# Altium schematic sheet 假肢驱动电路.SchDoc
size A1
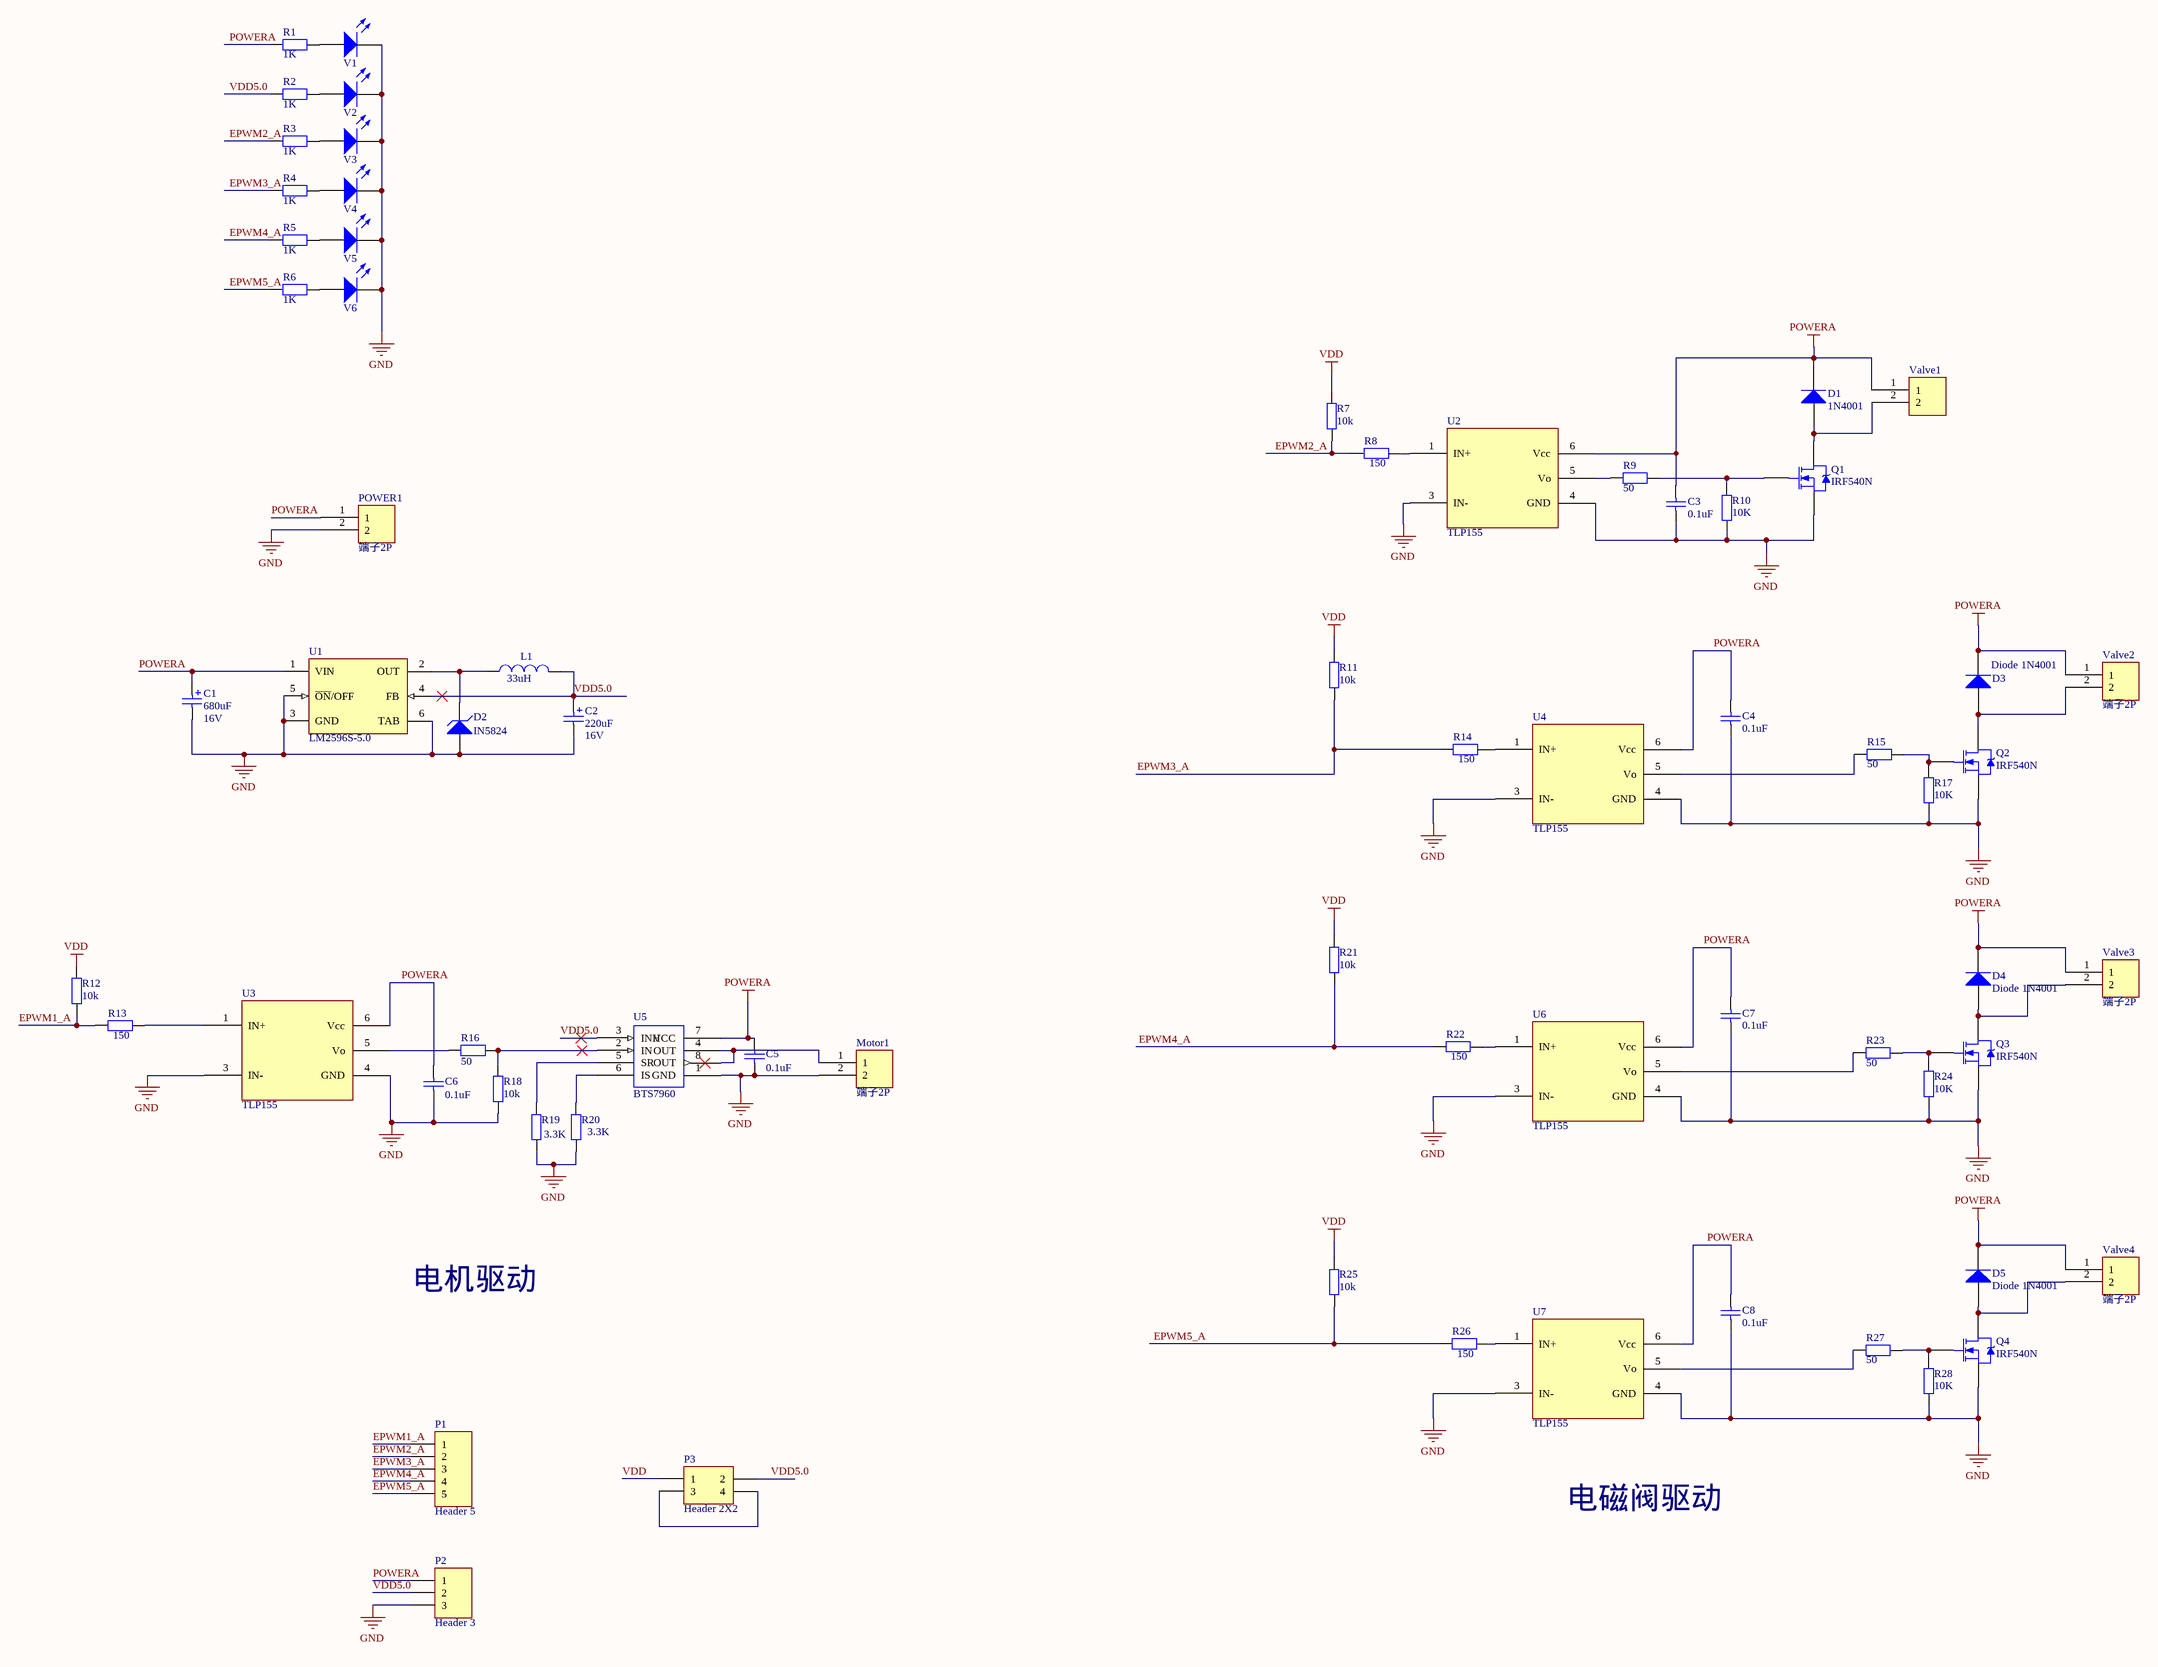
[diagram p0: 假肢驱动电路.SchDoc]

## Parts
C1  value 680uF  Voltage: 16V  [SMD-EC-F10]  (hidden comment: 10uF,16V)
C2  value 220uF  Voltage: 16V  [SMD-EC-F8]  (hidden comment: 10uF,16V)
C3  0.1uF  [LC-0805_C]
C4  0.1uF  [LC-0805_C]
C5  0.1uF  [LC-0805_C]
C6  0.1uF  [LC-0805_C]
C7  0.1uF  [LC-0805_C]
C8  0.1uF  [LC-0805_C]
D1  1N4001  [DO-41]
D2  IN5824  [LC-1206]
D3  Diode 1N4001  [DO-41]
D4  Diode 1N4001  [DO-41]
D5  Diode 1N4001  [DO-41]
L1  value 33uH  [SMD-EC-F10]  (hidden comment: Inductor)
Motor1  端子2P  [KF2EDGK5.0-LI-2P]
P1  Header 5  [XH2.54-LI-5P]
P2  Header 3  [XH2.54-LI-3P]
P3  Header 2X2  [HDR2X2]
POWER1  端子2P  [KF2EDGK5.0-LI-2P]
Q1  IRF540N  [TO-220AB]
Q2  IRF540N  [TO-220AB]
Q3  IRF540N  [TO-220AB]
Q4  IRF540N  [TO-220AB]
R1  1K  [0603-1]
R2  1K  [0603-1]
R3  1K  [0603-1]
R4  1K  [0603-1]
R5  1K  [0603-1]
R6  1K  [0603-1]
R7  10k  [LC-0805_R]
R8  150  [LC-0805_R]
R9  50  [LC-0805_R]
R10  10K  [LC-0805_R]
R11  10k  [LC-0805_R]
R12  10k  [LC-0805_R]
R13  150  [0805-1]
R14  150  [LC-0805_R]
R15  50  [LC-0805_R]
R16  50  [LC-0805_R]
R17  10K  [LC-0805_R]
R18  10k  [0805-1]
R19  3.3K  [LC-0805_R]
R20  3.3K  [LC-0805_R]
R21  10k  [LC-0805_R]
R22  150  [LC-0805_R]
R23  50  [LC-0805_R]
R24  10K  [LC-0805_R]
R25  10k  [LC-0805_R]
R26  150  [LC-0805_R]
R27  50  [LC-0805_R]
R28  10K  [LC-0805_R]
U1  LM2596S-5.0  [TS5B_N]
U2  TLP155  [so6]
U3  TLP155  [so6]
U4  TLP155  [so6]
U5  BTS7960  [BTS7960]
U6  TLP155  [so6]
U7  TLP155  [so6]
V1  LED Chip  [LED 0603G]  (value not drawn)
V2  LED Chip  [LED 0603G]  (value not drawn)
V3  LED Chip  [LED 0603R]  (value not drawn)
V4  LED Chip  [LED 0603R]  (value not drawn)
V5  LED Chip  [LED 0603R]  (value not drawn)
V6  LED Chip  [LED 0603R]  (value not drawn)
Valve1  (no value)  [KF2EDGK5.0-LI-2P]
Valve2  端子2P  [KF2EDGK5.0-LI-2P]
Valve3  端子2P  [KF2EDGK5.0-LI-2P]
Valve4  端子2P  [KF2EDGK5.0-LI-2P]

## Nets
GND: C1.2 C2.2 C3.2 C4.2 C5.2 C6.2 C7.2 C8.2 D2.1(A) Motor1.2 P2.3 POWER1.2 Q1.3(S) Q2.3(S) Q3.3(S) Q4.3(S) R10.1 R17.1 R18.1 R19.1 R20.1 R24.1 R28.1 U1.3(GND) U1.5(~{ON}/OFF) U1.6(TAB) U2.3(IN-) U2.4(GND) U3.3(IN-) U3.4(GND) U4.3(IN-) U4.4(GND) U5.1(GND) U6.3(IN-) U6.4(GND) U7.3(IN-) U7.4(GND) V1.2(K) V2.2(K) V3.2(K) V4.2(K) V5.2(K) V6.2(K)
POWERA: C1.1 C3.1 C4.1 C5.1 C6.1 C7.1 C8.1 D1.2(K) D3.2(K) D4.2(K) D5.2(K) P2.1 POWER1.1 R1.1 U1.1(VIN) U2.6(Vcc) U3.6(Vcc) U4.6(Vcc) U5.7(VCC) U6.6(Vcc) U7.6(Vcc) Valve1.1 Valve2.1 Valve3.1 Valve4.1
VDD: P3.1 R7.2 R11.2 R12.2 R21.2 R25.2
EPWM1_A: P1.1 R12.1 R13.1
EPWM2_A: P1.2 R3.1 R7.1 R8.1
EPWM3_A: P1.3 R4.1 R11.1 R14.1
EPWM4_A: P1.4 R5.1 R21.1 R22.1
EPWM5_A: P1.5 R6.1 R25.1 R26.1
VDD5.0: C2.1 L1.2 P2.2 P3.2 R2.1 U1.4(FB) U5.3(INH)
NetD1_1: D1.1(A) Q1.2(D) Valve1.2
NetD2_2: D2.2(K) L1.1 U1.2(OUT)
NetD3_1: D3.1(A) Q2.2(D) Valve2.2
NetD4_1: D4.1(A) Q3.2(D) Valve3.2
NetD5_1: D5.1(A) Q4.2(D) Valve4.2
NetMotor1_1: Motor1.1 U5.4(OUT) U5.8(OUT)
NetP3_3: P3.3 P3.4
NetQ1_1: Q1.1(G) R9.2 R10.2
NetQ2_1: Q2.1(G) R15.2 R17.2
NetQ3_1: Q3.1(G) R23.2 R24.2
NetQ4_1: Q4.1(G) R27.2 R28.2
NetR1_2: R1.2 V1.1(A)
NetR2_2: R2.2 V2.1(A)
NetR3_2: R3.2 V3.1(A)
NetR4_2: R4.2 V4.1(A)
NetR5_2: R5.2 V5.1(A)
NetR6_2: R6.2 V6.1(A)
NetR8_2: R8.2 U2.1(IN+)
NetR9_1: R9.1 U2.5(Vo)
NetR13_2: R13.2 U3.1(IN+)
NetR14_2: R14.2 U4.1(IN+)
NetR15_1: R15.1 U4.5(Vo)
NetR16_1: R16.1 U3.5(Vo)
NetR16_2: R16.2 R18.2 U5.2(IN)
NetR19_2: R19.2 U5.5(SR)
NetR20_2: R20.2 U5.6(IS)
NetR22_2: R22.2 U6.1(IN+)
NetR23_1: R23.1 U6.5(Vo)
NetR26_2: R26.2 U7.1(IN+)
NetR27_1: R27.1 U7.5(Vo)

## Notes on the sheet
- 电机驱动
- 电磁阀驱动

## Library data of the parts
C1 C2 = Cap Pol 2x5: Polarized Capacitor (Radial); Published: 8-Jun-2000; Revision: July-2002: Re-released for DXP Platform.; Publisher: Altium Limited
C3-C8 = Cap: Capacitor; Published: 8-Jun-2000; LatestRevisionDate: 17-Jul-2002; LatestRevisionNote: Re-released for DXP Platform.; PackageReference: RAD-0.3; Publisher: Altium Limited; PackageDescription: Radial Cap, Thru-Hole; 2 Leads; 0.3 in Pin Spacing; Value: 0.1uF
D1 D3-D5 = Diode 1N4001: 1 Amp General Purpose Rectifier; Published: 8-Jun-2000; LatestRevisionDate: 17-Jul-2002; LatestRevisionNote: Re-released for DXP Platform.; DatasheetVersion: 1998; PackageVersion: Aug-1999; PackageReference: DO-41; Publisher: Altium Limited; PackageDescription: Diode, Axial; Body 5.2 x 2.7 mm (LxDia. max), Lead Dia. 0.86 mm (max); Code_JEDEC: DO-204-AL; ComponentLink1Description: Manufacturer Link; ComponentLink1URL: http://www.fairchildsemi.com/; ComponentLink2Description: Datasheet; ComponentLink2URL: http://www.fairchildsemi.com/ds/1N%2F1N4001.pdf
D2 = Diode  Zener: Zener Diode; Published: 8-Jun-2000; Revision: July-2002: Re-released for DXP Platform.; Publisher: Altium Limited
L1 = Inductor: Code_IEC: 1005; Published: 8-Jun-2000; LatestRevisionDate: 29-May-2009; LatestRevisionNote: IPC-7351 Footprint Added.; PackageReference: 0402-A; Publisher: Altium Limited; PackageDescription: Chip Inductor; Code_JEITA: 0402
Motor1 POWER1 Valve1-Valve4 = DUANZI2
P1 = Header 5: Header, 5-Pin; LatestRevisionDate: 17-Jul-2002; LatestRevisionNote: Re-released for DXP Platform.; Publisher: Altium Limited
P2 = Header 3: Header, 3-Pin; LatestRevisionDate: 17-Jul-2002; LatestRevisionNote: Re-released for DXP Platform.; Publisher: Altium Limited
P3 = Header 2X2: Header, 2-Pin, Dual row; LatestRevisionDate: 17-Jul-2002; LatestRevisionNote: Re-released for DXP Platform.; Publisher: Altium Limited
Q1-Q4 = IRF540N: HEXFET Power MOSFET; Note: Pin 2 is electrically connected to pin 4.; Sim Note: Thermal Model provided is not called on from main Subckt.; Published: 8-Jun-2000; LatestRevisionDate: 17-Jul-2002; LatestRevisionNote: Re-released for DXP Platform.; DatasheetVersion: May-1998; PackageVersion: Feb-1997; PackageReference: TO-220AB; Publisher: Altium Limited; PackageDescription: TO, Thru-Hole, Vertical, Heatsink Mounted; 3 In-Line Leads; Pitch 2.54 mm; ComponentLink1Description: Manufacturer Link; ComponentLink1URL: http://www.irf.com/; ComponentLink2Description: Datasheet; ComponentLink2URL: http://www.irf.com/product-info/datasheets/data/irf540n.pdf
R1-R6 = Resistor Chip 0805: Resistor; Published: 8-Jun-2000; Revision: July-2002: Re-released for DXP Platform.; Publisher: Altium Limited; Value: 1K
R7-R28 = Res2: Resistor; Published: 8-Jun-2000; LatestRevisionDate: 17-Jul-2002; LatestRevisionNote: Re-released for DXP Platform.; PackageReference: AXIAL-0.4; Publisher: Altium Limited; PackageDescription: Axial Device, Thru-Hole; 2 Leads; 0.4 in Pin Spacing
  R7 R11 R12 R18 R21 R25: Value: 10k
  R8 R13 R14 R22 R26: Value: 150
  R9 R15 R16 R23 R27: Value: 50
  R10 R17 R24 R28: Value: 10K
  R19 R20: Value: 3.3K
U1 = LM2596S-5.0: SIMPLE SWITCHER?Power Converter 150 KHz 3A Step-Down Voltage Regulator, 5-pin TO-263; Manufacturer: National Semiconductor; PackageTopMarking: NSUZXYTTE#*LM2596S*-5.0 P+; PowerWise: N; Published: 4-Dec-2008; DatasheetVersion: May-2002; PackageVersion: revD, Apr-2005; PackageReference: TS5B; Publisher: Altium Limited; PackageDescription: TO-263, Molded, .400 x .390 x .180in, 5 Lead, .067in Pitch, Surface Mount; Supplier 1: Farnell; Supplier Part Number 1: 1214546; PartNumber: LM2596S-5.0; RoHS: N; PinCount: 5; CompType: Switcher; Code_JEDEC: MO-169-AB; ComponentLink1Description: LM2596 Datasheet; ComponentLink1URL: http://www.national.com/ds/LM/LM2596.pdf; ComponentLink2Description: LM2596 Web Page; ComponentLink2URL: http://www.national.com/pf/LM/LM2596.html; ComponentLink3Description: TS5B Package Page; ComponentLink3URL: http://www.national.com/packaging/folders/ts5b.html
U5 = Component_1_1
V1-V6 = LED Chip: Typical Chip LED; Published: 8-Jun-2000; Revision: July-2002: Re-released for DXP Platform.; Publisher: Altium Limited